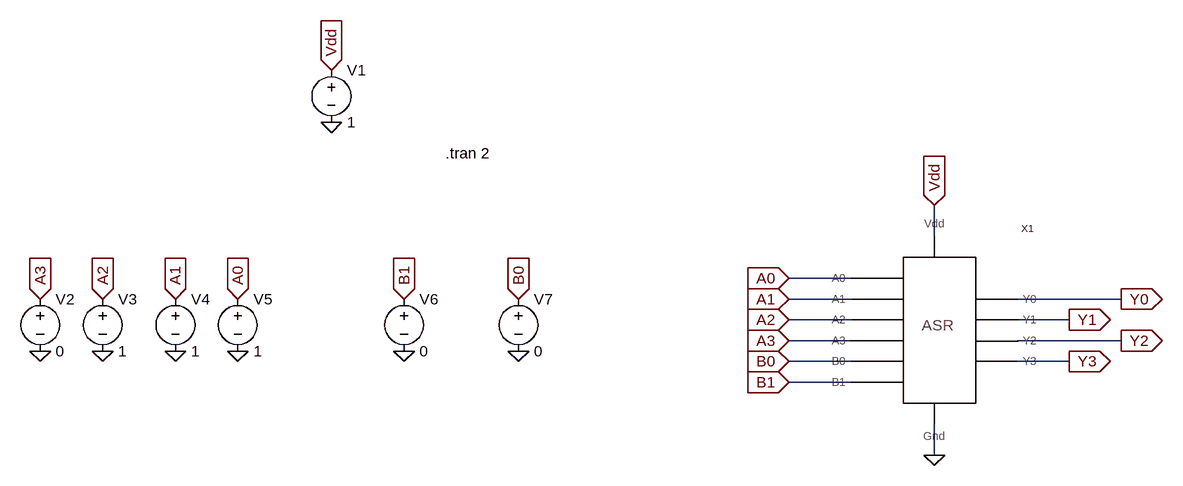
[diagram p0: schematic ALU_ASR_Test.asc]
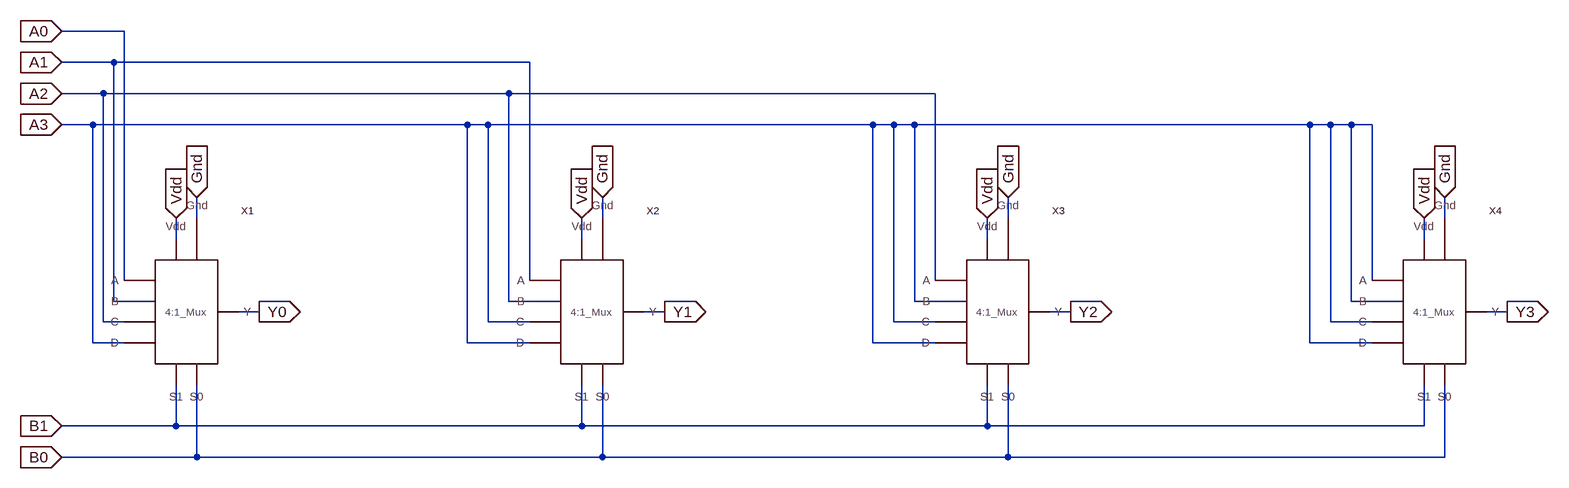
[diagram p1: sub-circuit alu_asr.asc]
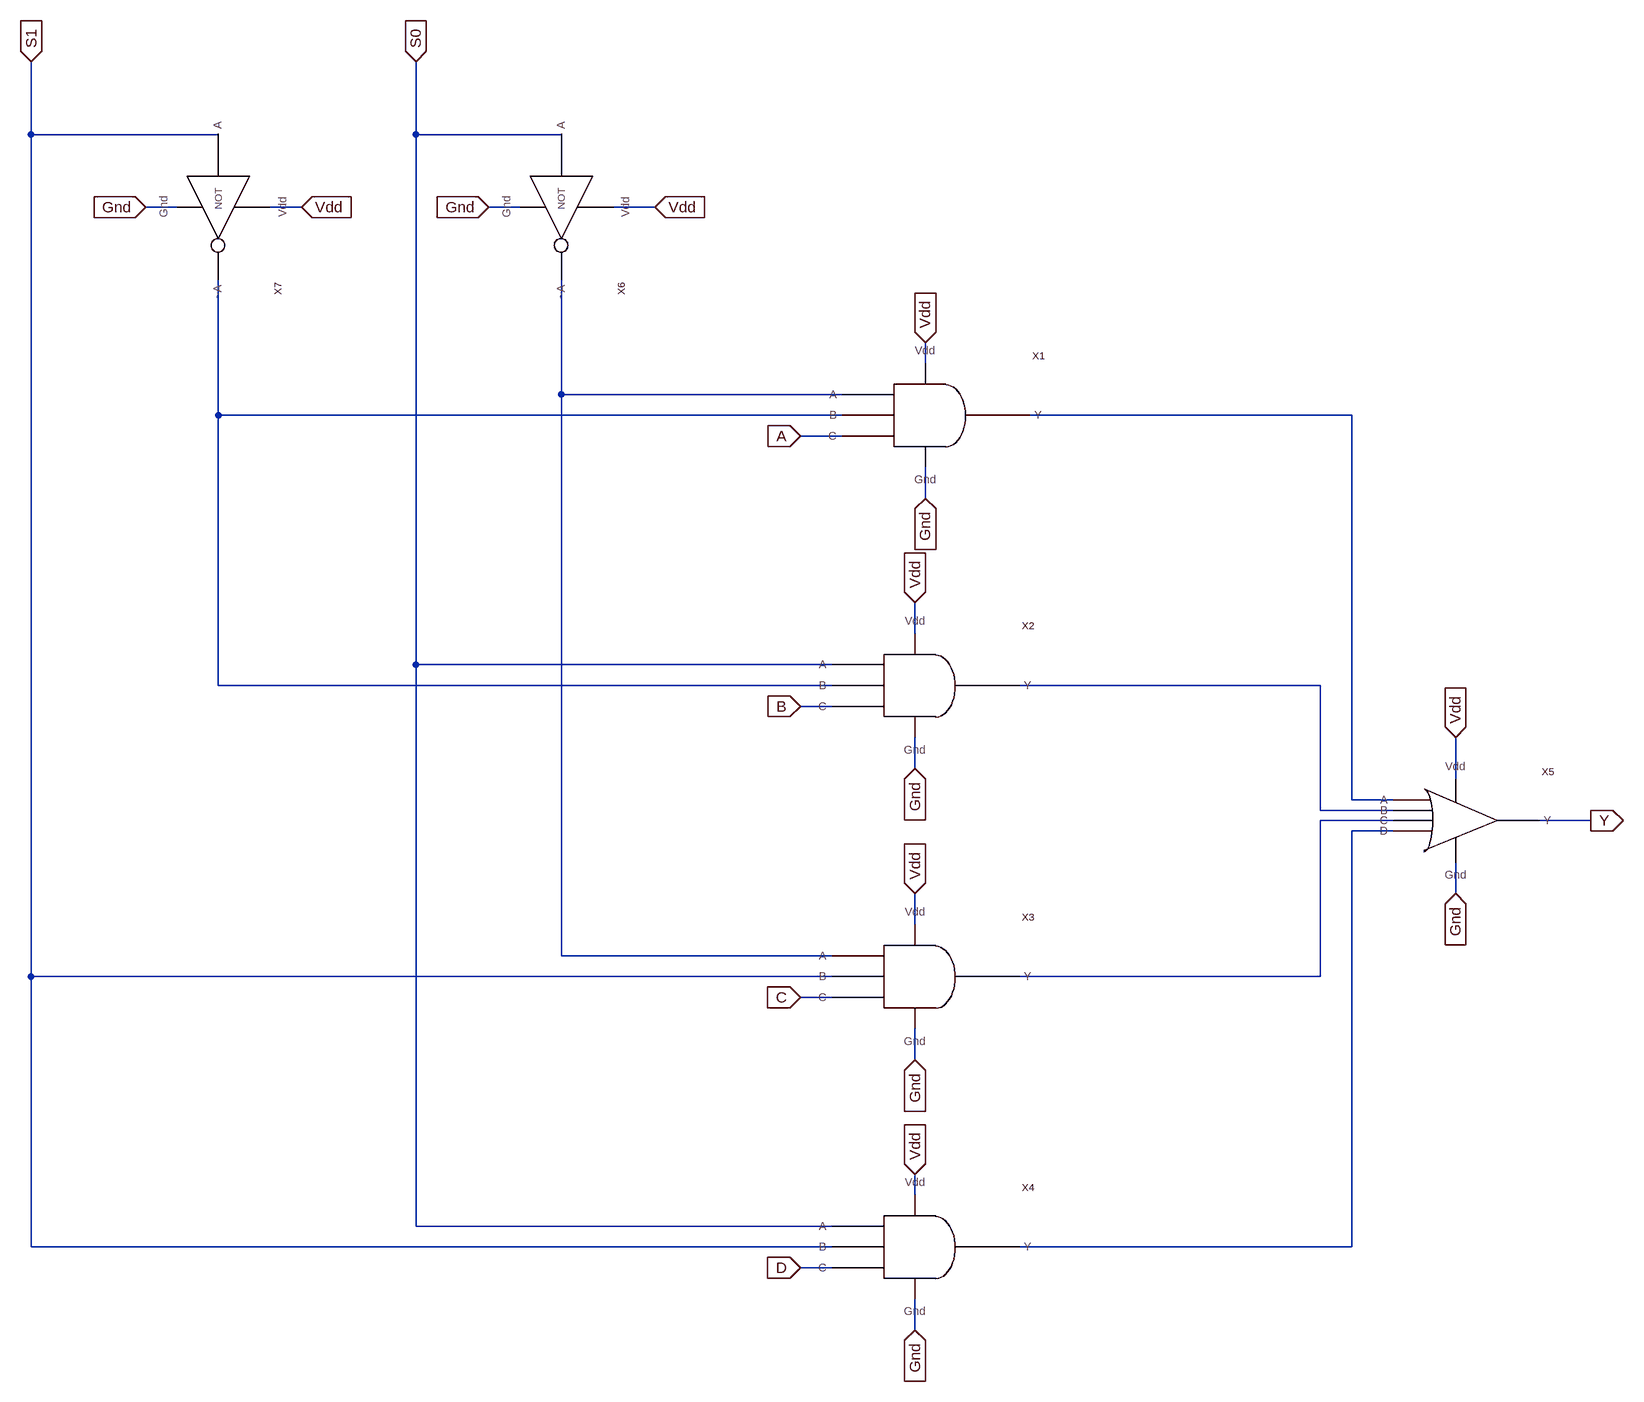
[diagram p2: sub-circuit 41_mux.asc]
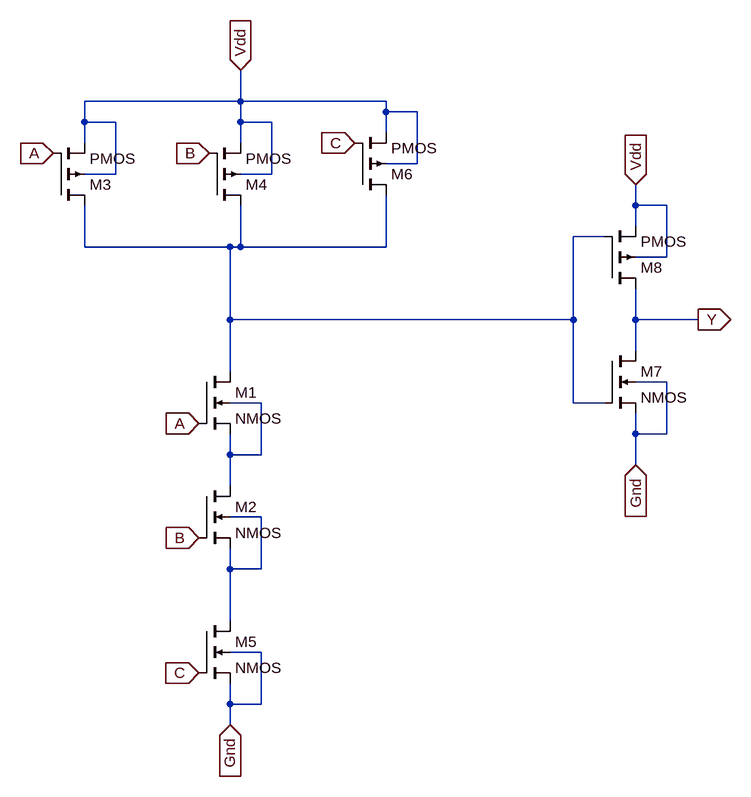
[diagram p3: sub-circuit 3iand.asc]
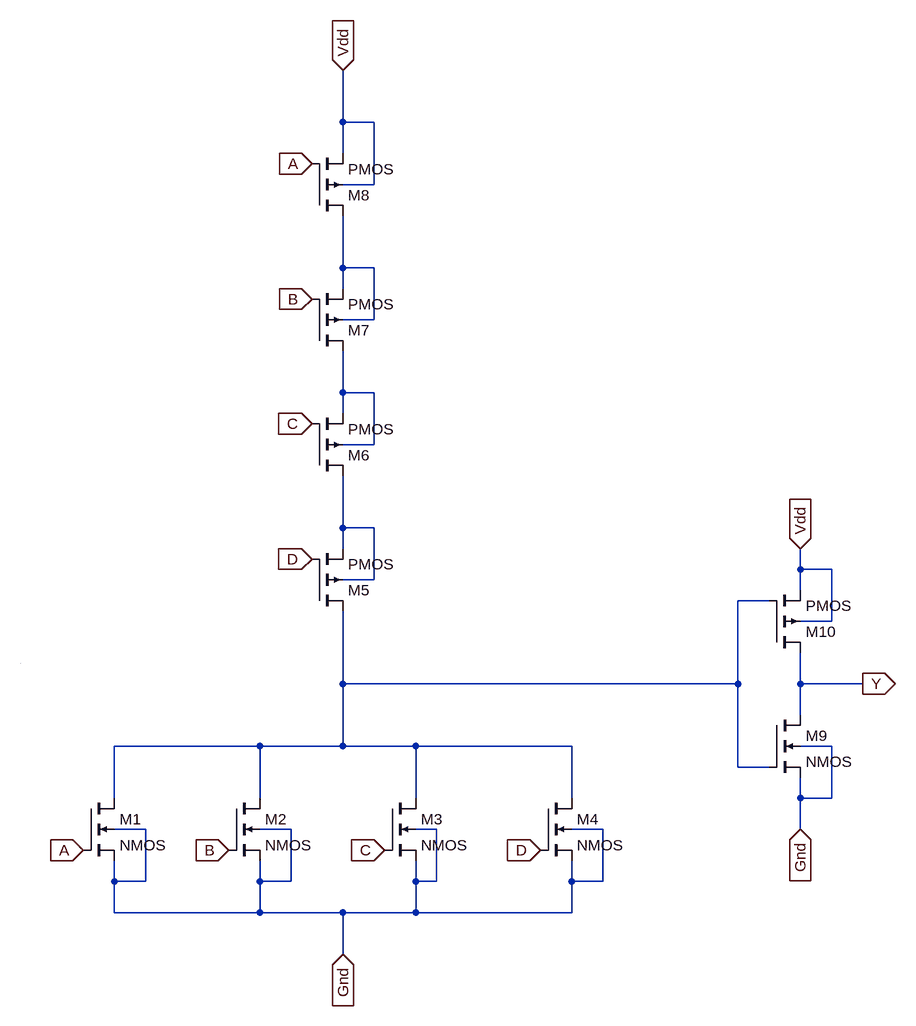
[diagram p4: sub-circuit 4i_or.asc]
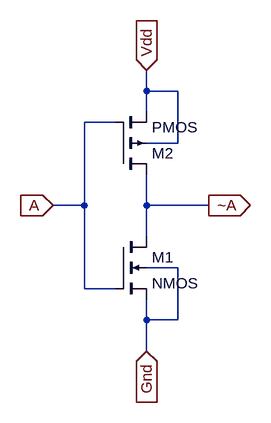
[diagram p5: sub-circuit not.asc]
ALU_ASR_Test.asc, the LTspice schematic file:
Version 4
SHEET 1 880 680
WIRE 336 48 336 0
WIRE 208 112 112 112
WIRE 208 144 112 144
WIRE 624 144 464 144
WIRE 208 176 112 176
WIRE 544 176 464 176
WIRE 208 208 112 208
WIRE 624 208 464 208
WIRE 208 240 112 240
WIRE 544 240 464 240
WIRE 208 272 112 272
WIRE 336 384 336 336
FLAG 336 0 Vdd
IOPIN 336 0 In
FLAG 112 112 A0
IOPIN 112 112 In
FLAG 112 144 A1
IOPIN 112 144 In
FLAG 112 176 A2
IOPIN 112 176 In
FLAG 112 208 A3
IOPIN 112 208 In
FLAG 112 240 B0
IOPIN 112 240 In
FLAG 112 272 B1
IOPIN 112 272 In
FLAG 624 144 Y0
IOPIN 624 144 Out
FLAG 544 176 Y1
IOPIN 544 176 Out
FLAG 624 208 Y2
IOPIN 624 208 Out
FLAG 544 240 Y3
IOPIN 544 240 Out
FLAG 336 384 0
FLAG -304 224 0
FLAG -480 224 0
FLAG -736 224 0
FLAG -832 224 0
FLAG -944 224 0
FLAG -1040 224 0
FLAG -592 -128 0
FLAG -592 -208 Vdd
IOPIN -592 -208 In
FLAG -1040 144 A3
IOPIN -1040 144 In
FLAG -944 144 A2
IOPIN -944 144 In
FLAG -832 144 A1
IOPIN -832 144 In
FLAG -736 144 A0
IOPIN -736 144 In
FLAG -480 144 B1
IOPIN -480 144 In
FLAG -304 144 B0
IOPIN -304 144 In
SYMBOL ALU_ASR 352 144 R0
SYMATTR InstName X1
SYMBOL voltage -592 -224 R0
WINDOW 123 0 0 Left 0
WINDOW 39 0 0 Left 0
SYMATTR InstName V1
SYMATTR Value 1
SYMBOL voltage -1040 128 R0
WINDOW 123 0 0 Left 0
WINDOW 39 0 0 Left 0
SYMATTR InstName V2
SYMATTR Value 0
SYMBOL voltage -944 128 R0
WINDOW 123 0 0 Left 0
WINDOW 39 0 0 Left 0
SYMATTR InstName V3
SYMATTR Value 1
SYMBOL voltage -832 128 R0
WINDOW 123 0 0 Left 0
WINDOW 39 0 0 Left 0
SYMATTR InstName V4
SYMATTR Value 1
SYMBOL voltage -736 128 R0
WINDOW 123 0 0 Left 0
WINDOW 39 0 0 Left 0
SYMATTR InstName V5
SYMATTR Value 1
SYMBOL voltage -480 128 R0
WINDOW 123 0 0 Left 0
WINDOW 39 0 0 Left 0
SYMATTR InstName V6
SYMATTR Value 0
SYMBOL voltage -304 128 R0
WINDOW 123 0 0 Left 0
WINDOW 39 0 0 Left 0
SYMATTR InstName V7
SYMATTR Value 0
TEXT -416 -80 Left 2 !.tran 2

alu_asr.asc, the sub-circuit schematic file:
Version 4
SHEET 1 2120 680
WIRE -96 -240 -192 -240
WIRE -112 -192 -192 -192
WIRE 528 -192 -112 -192
WIRE -128 -144 -192 -144
WIRE 496 -144 -128 -144
WIRE 1152 -144 496 -144
WIRE -144 -96 -192 -96
WIRE 432 -96 -144 -96
WIRE 464 -96 432 -96
WIRE 1056 -96 464 -96
WIRE 1088 -96 1056 -96
WIRE 1120 -96 1088 -96
WIRE 1728 -96 1120 -96
WIRE 1760 -96 1728 -96
WIRE 1792 -96 1760 -96
WIRE 1824 -96 1792 -96
WIRE 16 48 16 16
WIRE 640 48 640 16
WIRE 1264 48 1264 16
WIRE 1936 48 1936 16
WIRE -16 80 -16 48
WIRE 608 80 608 48
WIRE 1232 80 1232 48
WIRE 1904 80 1904 48
WIRE -96 144 -96 -240
WIRE 528 144 528 -192
WIRE 1152 144 1152 -144
WIRE 1824 144 1824 -96
WIRE -112 176 -112 -192
WIRE -96 176 -112 176
WIRE 496 176 496 -144
WIRE 528 176 496 176
WIRE 1120 176 1120 -96
WIRE 1152 176 1120 176
WIRE 1792 176 1792 -96
WIRE 1824 176 1792 176
WIRE 112 192 80 192
WIRE 736 192 704 192
WIRE 1360 192 1328 192
WIRE 2032 192 2000 192
WIRE -128 208 -128 -144
WIRE -96 208 -128 208
WIRE 464 208 464 -96
WIRE 528 208 464 208
WIRE 1088 208 1088 -96
WIRE 1152 208 1088 208
WIRE 1760 208 1760 -96
WIRE 1824 208 1760 208
WIRE -144 240 -144 -96
WIRE -96 240 -144 240
WIRE 432 240 432 -96
WIRE 528 240 432 240
WIRE 1056 240 1056 -96
WIRE 1152 240 1056 240
WIRE 1728 240 1728 -96
WIRE 1824 240 1728 240
WIRE -16 368 -16 304
WIRE -16 368 -192 368
WIRE 608 368 608 304
WIRE 608 368 -16 368
WIRE 1232 368 1232 304
WIRE 1232 368 608 368
WIRE 1904 368 1904 304
WIRE 1904 368 1232 368
WIRE 16 416 16 304
WIRE 16 416 -192 416
WIRE 640 416 640 304
WIRE 640 416 16 416
WIRE 1264 416 1264 304
WIRE 1264 416 640 416
WIRE 1936 416 1936 304
WIRE 1936 416 1264 416
FLAG -192 -240 A0
IOPIN -192 -240 In
FLAG -192 -192 A1
IOPIN -192 -192 In
FLAG -192 -144 A2
IOPIN -192 -144 In
FLAG -192 -96 A3
IOPIN -192 -96 In
FLAG -192 368 B1
IOPIN -192 368 In
FLAG -192 416 B0
IOPIN -192 416 In
FLAG -16 48 Vdd
IOPIN -16 48 In
FLAG 608 48 Vdd
IOPIN 608 48 In
FLAG 1232 48 Vdd
IOPIN 1232 48 In
FLAG 1904 48 Vdd
IOPIN 1904 48 In
FLAG 112 192 Y0
IOPIN 112 192 Out
FLAG 736 192 Y1
IOPIN 736 192 Out
FLAG 1360 192 Y2
IOPIN 1360 192 Out
FLAG 2032 192 Y3
IOPIN 2032 192 Out
FLAG 1936 16 Gnd
IOPIN 1936 16 In
FLAG 1264 16 Gnd
IOPIN 1264 16 In
FLAG 640 16 Gnd
IOPIN 640 16 In
FLAG 16 16 Gnd
IOPIN 16 16 In
SYMBOL 41_MUX 16 176 R0
SYMATTR InstName X1
SYMBOL 41_MUX 640 176 R0
SYMATTR InstName X2
SYMBOL 41_MUX 1264 176 R0
SYMATTR InstName X3
SYMBOL 41_MUX 1936 176 R0
SYMATTR InstName X4

41_mux.asc, the sub-circuit schematic file:
Version 4
SHEET 1 1324 1336
WIRE -1152 -608 -1152 -720
WIRE -864 -608 -1152 -608
WIRE -560 -608 -560 -720
WIRE -336 -608 -560 -608
WIRE -928 -496 -976 -496
WIRE -736 -496 -784 -496
WIRE -400 -496 -448 -496
WIRE -192 -496 -256 -496
WIRE 224 -256 224 -288
WIRE -336 -208 -336 -384
WIRE 96 -208 -336 -208
WIRE -864 -176 -864 -384
WIRE 96 -176 -864 -176
WIRE 880 -176 384 -176
WIRE 96 -144 32 -144
WIRE 224 -48 224 -96
WIRE 208 160 208 112
WIRE -560 208 -560 -608
WIRE 80 208 -560 208
WIRE -864 240 -864 -176
WIRE 80 240 -864 240
WIRE 832 240 368 240
WIRE 80 272 32 272
WIRE 208 368 208 320
WIRE 1040 384 1040 320
WIRE 880 416 880 -176
WIRE 944 416 880 416
WIRE 832 432 832 240
WIRE 944 432 832 432
WIRE 944 448 832 448
WIRE 1248 448 1168 448
WIRE 944 464 880 464
WIRE 1040 560 1040 512
WIRE 208 608 208 560
WIRE -336 656 -336 -208
WIRE 80 656 -336 656
WIRE -1152 688 -1152 -608
WIRE 80 688 -1152 688
WIRE 832 688 832 448
WIRE 832 688 368 688
WIRE 80 720 32 720
WIRE 208 816 208 768
WIRE 208 1024 208 992
WIRE -560 1072 -560 208
WIRE 80 1072 -560 1072
WIRE -1152 1104 -1152 688
WIRE 80 1104 -1152 1104
WIRE 880 1104 880 464
WIRE 880 1104 368 1104
WIRE 80 1136 32 1136
WIRE 208 1232 208 1184
FLAG -560 -720 S0
IOPIN -560 -720 In
FLAG -1152 -720 S1
IOPIN -1152 -720 In
FLAG 32 -144 A
IOPIN 32 -144 In
FLAG 32 272 B
IOPIN 32 272 In
FLAG 32 720 C
IOPIN 32 720 In
FLAG 32 1136 D
IOPIN 32 1136 In
FLAG -976 -496 Gnd
IOPIN -976 -496 In
FLAG -448 -496 Gnd
IOPIN -448 -496 In
FLAG 224 -48 Gnd
IOPIN 224 -48 In
FLAG 208 368 Gnd
IOPIN 208 368 In
FLAG 208 816 Gnd
IOPIN 208 816 In
FLAG 208 1232 Gnd
IOPIN 208 1232 In
FLAG 1040 560 Gnd
IOPIN 1040 560 In
FLAG 1040 320 Vdd
IOPIN 1040 320 In
FLAG 208 992 Vdd
IOPIN 208 992 In
FLAG 208 560 Vdd
IOPIN 208 560 In
FLAG 208 112 Vdd
IOPIN 208 112 In
FLAG 224 -288 Vdd
IOPIN 224 -288 In
FLAG -192 -496 Vdd
IOPIN -192 -496 In
FLAG -736 -496 Vdd
IOPIN -736 -496 In
FLAG 1248 448 Y
IOPIN 1248 448 Out
SYMBOL 3iAND 224 -192 R0
SYMATTR InstName X1
SYMBOL 3iAND 208 224 R0
SYMATTR InstName X2
SYMBOL 3iAND 208 672 R0
SYMATTR InstName X3
SYMBOL 3iAND 208 1088 R0
SYMATTR InstName X4
SYMBOL 4i_OR 1072 464 R0
SYMATTR InstName X5
SYMBOL NOT -320 -496 R90
SYMATTR InstName X6
SYMBOL NOT -848 -496 R90
SYMATTR InstName X7

3iand.asc, the sub-circuit schematic file:
Version 4
SHEET 1 1036 936
WIRE 240 -128 240 -176
WIRE 240 -128 0 -128
WIRE 464 -128 240 -128
WIRE 464 -112 464 -128
WIRE 512 -112 464 -112
WIRE 0 -96 0 -128
WIRE 48 -96 0 -96
WIRE 240 -96 240 -128
WIRE 288 -96 240 -96
WIRE 464 -80 464 -112
WIRE 0 -64 0 -96
WIRE 240 -64 240 -96
WIRE 512 -32 512 -112
WIRE 512 -32 464 -32
WIRE 48 -16 48 -96
WIRE 48 -16 0 -16
WIRE 288 -16 288 -96
WIRE 288 -16 240 -16
WIRE 848 32 848 0
WIRE 896 32 848 32
WIRE 848 64 848 32
WIRE 800 80 752 80
WIRE 0 96 0 32
WIRE 224 96 0 96
WIRE 240 96 240 32
WIRE 240 96 224 96
WIRE 464 96 464 16
WIRE 464 96 240 96
WIRE 896 112 896 32
WIRE 896 112 848 112
WIRE 224 208 224 96
WIRE 752 208 752 80
WIRE 752 208 224 208
WIRE 848 208 848 160
WIRE 944 208 848 208
WIRE 848 256 848 208
WIRE 224 288 224 208
WIRE 896 304 848 304
WIRE 272 336 224 336
WIRE 752 336 752 208
WIRE 800 336 752 336
WIRE 848 384 848 352
WIRE 896 384 896 304
WIRE 896 384 848 384
WIRE 224 416 224 384
WIRE 272 416 272 336
WIRE 272 416 224 416
WIRE 848 432 848 384
WIRE 224 464 224 416
WIRE 272 512 224 512
WIRE 224 592 224 560
WIRE 272 592 272 512
WIRE 272 592 224 592
WIRE 224 672 224 592
WIRE 272 720 224 720
WIRE 224 800 224 768
WIRE 272 800 272 720
WIRE 272 800 224 800
WIRE 224 832 224 800
FLAG 176 544 B
IOPIN 176 544 In
FLAG 176 368 A
IOPIN 176 368 In
FLAG -48 -48 A
IOPIN -48 -48 In
FLAG 192 -48 B
IOPIN 192 -48 In
FLAG 240 -176 Vdd
IOPIN 240 -176 In
FLAG 176 752 C
IOPIN 176 752 In
FLAG 416 -64 C
IOPIN 416 -64 In
FLAG 224 832 Gnd
IOPIN 224 832 In
FLAG 848 0 Vdd
IOPIN 848 0 In
FLAG 848 432 Gnd
IOPIN 848 432 In
FLAG 944 208 Y
IOPIN 944 208 Out
SYMBOL nmos4 176 288 R0
SYMATTR InstName M1
SYMBOL nmos4 176 464 R0
SYMATTR InstName M2
SYMBOL pmos4 -48 32 M180
SYMATTR InstName M3
SYMBOL pmos4 192 32 M180
SYMATTR InstName M4
SYMBOL nmos4 176 672 R0
SYMATTR InstName M5
SYMBOL pmos4 416 16 M180
SYMATTR InstName M6
SYMBOL nmos4 800 256 R0
SYMATTR InstName M7
SYMBOL pmos4 800 160 M180
SYMATTR InstName M8

4i_or.asc, the sub-circuit schematic file:
Version 4
SHEET 1 1372 680
WIRE 496 -832 496 -912
WIRE 544 -832 496 -832
WIRE 496 -784 496 -832
WIRE 544 -736 544 -832
WIRE 544 -736 496 -736
WIRE 496 -608 496 -688
WIRE 544 -608 496 -608
WIRE 496 -576 496 -608
WIRE 544 -528 544 -608
WIRE 544 -528 496 -528
WIRE 496 -416 496 -480
WIRE 544 -416 496 -416
WIRE 496 -384 496 -416
WIRE 544 -336 544 -416
WIRE 544 -336 496 -336
WIRE 496 -208 496 -288
WIRE 544 -208 496 -208
WIRE 496 -176 496 -208
WIRE 1200 -144 1200 -176
WIRE 1248 -144 1200 -144
WIRE 544 -128 544 -208
WIRE 544 -128 496 -128
WIRE 1200 -112 1200 -144
WIRE 1152 -96 1104 -96
WIRE 1248 -64 1248 -144
WIRE 1248 -64 1200 -64
WIRE 496 32 496 -80
WIRE 1104 32 1104 -96
WIRE 1104 32 496 32
WIRE 1200 32 1200 -16
WIRE 1296 32 1200 32
WIRE 1200 80 1200 32
WIRE 368 128 144 128
WIRE 496 128 496 32
WIRE 496 128 368 128
WIRE 608 128 496 128
WIRE 848 128 608 128
WIRE 1248 128 1200 128
WIRE 1104 160 1104 32
WIRE 1152 160 1104 160
WIRE 144 208 144 128
WIRE 368 208 368 128
WIRE 608 208 608 128
WIRE 848 208 848 128
WIRE 1200 208 1200 176
WIRE 1248 208 1248 128
WIRE 1248 208 1200 208
WIRE 192 256 144 256
WIRE 416 256 368 256
WIRE 640 256 608 256
WIRE 896 256 848 256
WIRE 1200 256 1200 208
WIRE 144 336 144 304
WIRE 192 336 192 256
WIRE 192 336 144 336
WIRE 368 336 368 304
WIRE 416 336 416 256
WIRE 416 336 368 336
WIRE 608 336 608 304
WIRE 640 336 640 256
WIRE 640 336 608 336
WIRE 848 336 848 304
WIRE 896 336 896 256
WIRE 896 336 848 336
WIRE 144 384 144 336
WIRE 368 384 368 336
WIRE 368 384 144 384
WIRE 496 384 368 384
WIRE 608 384 608 336
WIRE 608 384 496 384
WIRE 848 384 848 336
WIRE 848 384 608 384
WIRE 496 448 496 384
WIRE 0 0 0 0
FLAG 496 -912 Vdd
IOPIN 496 -912 In
FLAG 448 -768 A
IOPIN 448 -768 In
FLAG 448 -560 B
IOPIN 448 -560 In
FLAG 448 -368 C
IOPIN 448 -368 In
FLAG 448 -160 D
IOPIN 448 -160 In
FLAG 96 288 A
IOPIN 96 288 In
FLAG 320 288 B
IOPIN 320 288 In
FLAG 560 288 C
IOPIN 560 288 In
FLAG 800 288 D
IOPIN 800 288 In
FLAG 496 448 Gnd
IOPIN 496 448 In
FLAG 1200 -176 Vdd
IOPIN 1200 -176 In
FLAG 1200 256 Gnd
IOPIN 1200 256 In
FLAG 1296 32 Y
IOPIN 1296 32 Out
SYMBOL nmos4 96 208 R0
SYMATTR InstName M1
SYMBOL nmos4 320 208 R0
SYMATTR InstName M2
SYMBOL nmos4 560 208 R0
SYMATTR InstName M3
SYMBOL nmos4 800 208 R0
SYMATTR InstName M4
SYMBOL pmos4 448 -80 M180
SYMATTR InstName M5
SYMBOL pmos4 448 -288 M180
SYMATTR InstName M6
SYMBOL pmos4 448 -480 M180
SYMATTR InstName M7
SYMBOL pmos4 448 -688 M180
SYMATTR InstName M8
SYMBOL nmos4 1152 80 R0
SYMATTR InstName M9
SYMBOL pmos4 1152 -16 M180
SYMATTR InstName M10

not.asc, the sub-circuit schematic file:
Version 4
SHEET 1 880 680
WIRE 304 -112 304 -144
WIRE 352 -112 304 -112
WIRE 304 -80 304 -112
WIRE 256 -64 208 -64
WIRE 352 -32 352 -112
WIRE 352 -32 304 -32
WIRE 208 64 208 -64
WIRE 208 64 160 64
WIRE 304 64 304 16
WIRE 400 64 304 64
WIRE 304 112 304 64
WIRE 352 160 304 160
WIRE 208 192 208 64
WIRE 256 192 208 192
WIRE 304 240 304 208
WIRE 352 240 352 160
WIRE 352 240 304 240
WIRE 304 288 304 240
FLAG 304 -144 Vdd
IOPIN 304 -144 In
FLAG 160 64 A
IOPIN 160 64 In
FLAG 400 64 ~A
IOPIN 400 64 Out
FLAG 304 288 Gnd
IOPIN 304 288 In
SYMBOL nmos4 256 112 R0
SYMATTR InstName M1
SYMBOL pmos4 256 16 M180
SYMATTR InstName M2

The netlist it stands for:
* ALU_ASR_Test.asc
XX1 A0 A1 A2 A3 B0 B1 Vdd 0 Y0 Y1 Y2 Y3 alu_asr
V1 Vdd 0 1
V2 A3 0 0
V3 A2 0 1
V4 A1 0 1
V5 A0 0 1
V6 B1 0 0
V7 B0 0 0

* block symbol definitions
.subckt alu_asr A0 A1 A2 A3 B0 B1 Vdd Gnd Y0 Y1 Y2 Y3
XX1 A0 A1 A2 A3 B0 B1 Y0 Vdd Gnd 41_mux
XX2 A1 A2 A3 A3 B0 B1 Y1 Vdd Gnd 41_mux
XX3 A2 A3 A3 A3 B0 B1 Y2 Vdd Gnd 41_mux
XX4 A3 A3 A3 A3 B0 B1 Y3 Vdd Gnd 41_mux
.ends alu_asr

.subckt 41_mux A B C D S0 S1 Y Vdd Gnd
XX1 N001 N002 A Vdd Gnd N003 3iand
XX2 S0 N002 B Vdd Gnd N004 3iand
XX3 N001 S1 C Vdd Gnd N005 3iand
XX4 S0 S1 D Vdd Gnd N006 3iand
XX5 N003 N004 N005 N006 Vdd Gnd Y 4i_or
XX6 S0 N001 Vdd Gnd not
XX7 S1 N002 Vdd Gnd not
.ends 41_mux

.subckt 3iand A B C Vdd Gnd Y
M1 N001 A N002 N002 NMOS
M2 N002 B N003 N003 NMOS
M3 N001 A Vdd Vdd PMOS
M4 N001 B Vdd Vdd PMOS
M5 N003 C Gnd Gnd NMOS
M6 N001 C Vdd Vdd PMOS
M7 Y N001 Gnd Gnd NMOS
M8 Y N001 Vdd Vdd PMOS
.ends 3iand

.subckt 4i_or A B C D Vdd Gnd Y
M1 N004 A Gnd Gnd NMOS
M2 N004 B Gnd Gnd NMOS
M3 N004 C Gnd Gnd NMOS
M4 N004 D Gnd Gnd NMOS
M5 N004 D N003 N003 PMOS
M6 N003 C N002 N002 PMOS
M7 N002 B N001 N001 PMOS
M8 N001 A Vdd Vdd PMOS
M9 Y N004 Gnd Gnd NMOS
M10 Y N004 Vdd Vdd PMOS
.ends 4i_or

.subckt not A ~A Vdd Gnd
M1 ~A A Gnd Gnd NMOS
M2 ~A A Vdd Vdd PMOS
.ends not

.model NMOS NMOS
.model PMOS PMOS
.lib standard.mos
.tran 2
.backanno
.end